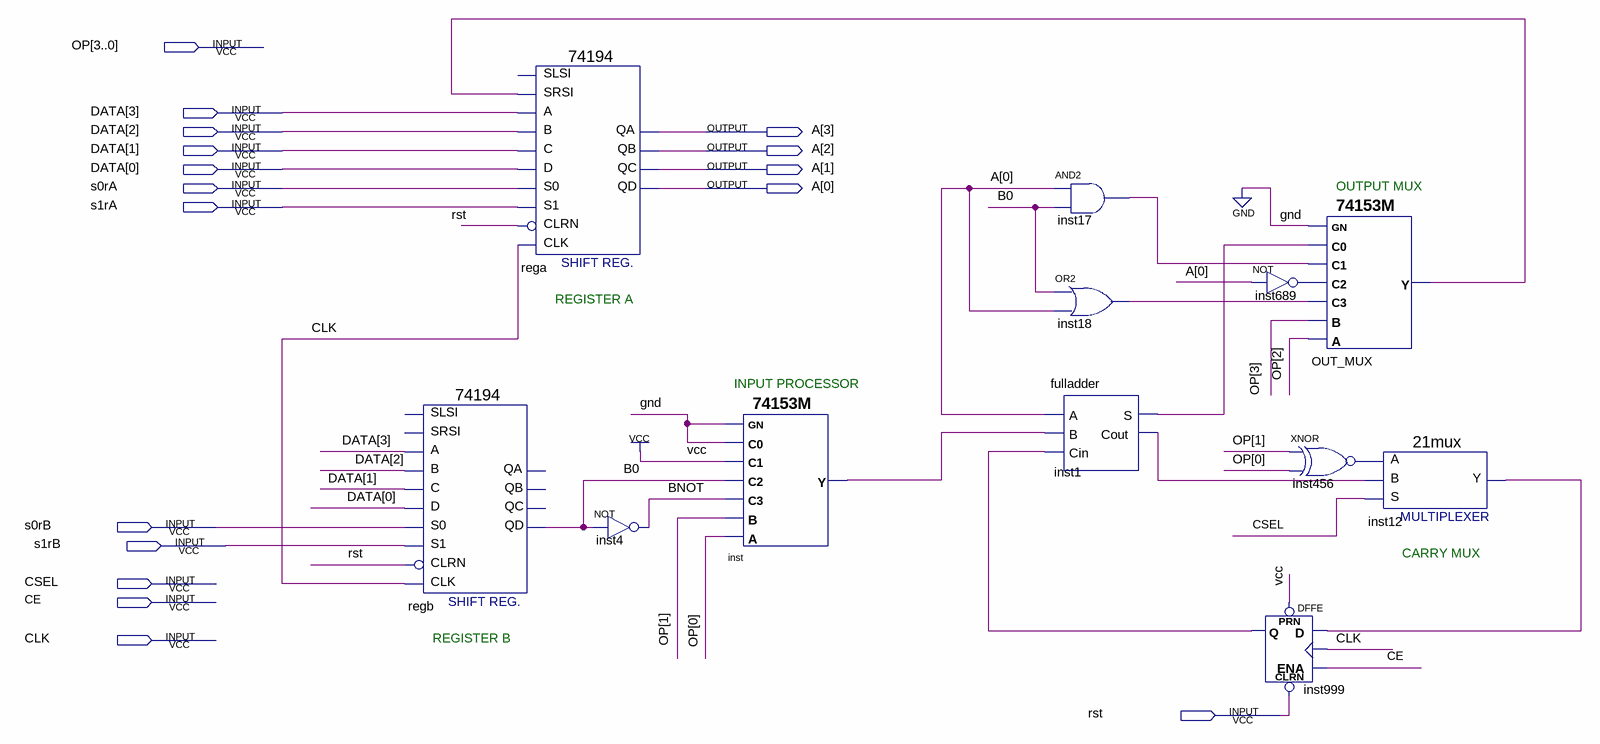
[diagram p0: schematic sheet]
// Quartus schematic DATAPATH.bdf as structural Verilog: 12 symbols, 17 pins
module DATAPATH (
  input  [3:0] OP,
  input  [3:0] DATA,
  input  s0rA,
  input  s1rA,
  input  s0rB,
  input  s1rB,
  input  CSEL,
  input  CE,
  input  CLK,
  input  rst,
  output [3:0] A
);

  wire B0, BNOT, inst1_cout, inst1_s, inst12_y, inst17_out, inst18_out, inst456_out, inst689_out, inst999_q,
       inst_y, OUT_MUX_y;

  \74194  regb (
    .B(DATA[2]), .C(DATA[1]), .CLK(CLK), .CLRN(rst), .D(DATA[0]), .S1(s1rB), .S0(s0rB), .A(DATA[3]), .QD(B0));  // open: SLSI, SRSI, QA, QB, QC
  \74194  rega (
    .SRSI(OUT_MUX_y), .B(DATA[2]), .C(DATA[1]), .CLK(CLK), .CLRN(rst), .D(DATA[0]), .S1(s1rA), .S0(s0rA),
    .A(DATA[3]), .QA(A[3]), .QB(A[2]), .QC(A[1]), .QD(A[0]));  // open: SLSI
  not inst4 (BNOT, B0);
  \74153M  inst (.A(OP[0]), .B(OP[1]), .C3(BNOT), .C2(B0), .C1(1'b1), .C0(1'b0), .GN(1'b0), .Y(inst_y));
  and inst17 (inst17_out, A[0], B0);
  or inst18 (inst18_out, B0, A[0]);
  fulladder inst1 (.A(A[0]), .B(inst_y), .Cin(inst999_q), .S(inst1_s), .Cout(inst1_cout));
  \74153M  OUT_MUX (
    .A(OP[2]), .B(OP[3]), .C3(inst18_out), .C2(inst689_out), .C1(inst17_out), .C0(inst1_s), .GN(1'b0),
    .Y(OUT_MUX_y));
  not inst689 (inst689_out, A[0]);
  xnor inst456 (inst456_out, OP[1], OP[0]);
  DFFE inst999 (.PRN(1'b1), .CLRN(rst), .D(inst12_y), .CLK(CLK), .ENA(CE), .Q(inst999_q));
  \21mux  inst12 (.S(CSEL), .B(inst1_cout), .A(inst456_out), .Y(inst12_y));

  // Notes on the sheet:
  //   OUTPUT MUX
  //   REGISTER A
  //   INPUT PROCESSOR
  //   CARRY MUX
  //   REGISTER B
endmodule
